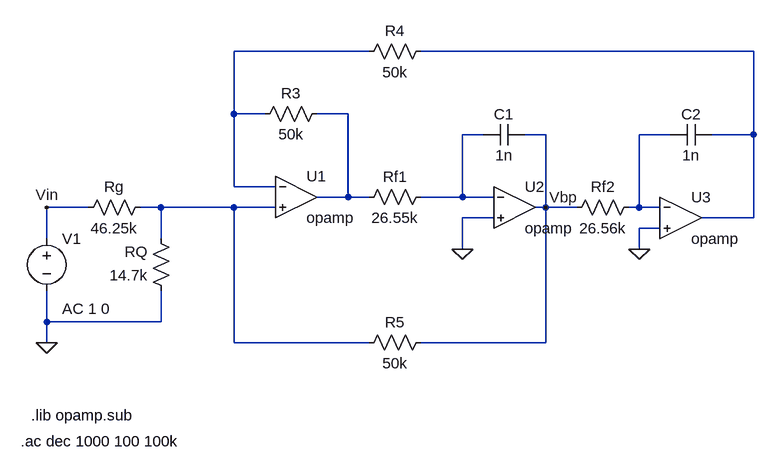
[diagram p0: schematic tplab.asc]
tplab.asc, the LTspice schematic file:
Version 4
SHEET 1 880 680
WIRE 144 -80 -64 -80
WIRE 736 -80 224 -80
WIRE -64 16 -64 -80
WIRE -16 16 -64 16
WIRE 112 16 64 16
WIRE 320 48 288 48
WIRE 416 48 384 48
WIRE 608 48 560 48
WIRE 736 48 736 -80
WIRE 736 48 672 48
WIRE -64 128 -64 16
WIRE 0 128 -64 128
WIRE 112 144 112 16
WIRE 112 144 64 144
WIRE 144 144 112 144
WIRE 288 144 288 48
WIRE 288 144 224 144
WIRE 336 144 288 144
WIRE -288 160 -352 160
WIRE -176 160 -208 160
WIRE -64 160 -176 160
WIRE 0 160 -64 160
WIRE 416 160 416 48
WIRE 416 160 400 160
WIRE 464 160 416 160
WIRE 560 160 560 48
WIRE 560 160 544 160
WIRE 592 160 560 160
WIRE 336 176 288 176
WIRE 736 176 736 48
WIRE 736 176 656 176
WIRE 592 192 560 192
WIRE -352 208 -352 160
WIRE -176 208 -176 160
WIRE 288 224 288 176
WIRE 560 224 560 192
WIRE -352 336 -352 288
WIRE -176 336 -176 288
WIRE -176 336 -352 336
WIRE -352 368 -352 336
WIRE -64 368 -64 160
WIRE 144 368 -64 368
WIRE 416 368 416 160
WIRE 416 368 224 368
FLAG -352 368 0
FLAG 288 224 0
FLAG 560 224 0
FLAG -352 160 Vin
FLAG 416 160 Vbp
SYMBOL OpAmps\\opamp 32 80 R0
SYMATTR InstName U1
SYMBOL OpAmps\\opamp 368 96 R0
SYMATTR InstName U2
SYMBOL OpAmps\\opamp 624 112 R0
SYMATTR InstName U3
SYMBOL res 240 128 R90
WINDOW 0 0 56 VBottom 2
WINDOW 3 32 56 VTop 2
SYMATTR InstName Rf1
SYMATTR Value 26.55k
SYMBOL res 560 144 R90
WINDOW 0 0 56 VBottom 2
WINDOW 3 32 56 VTop 2
SYMATTR InstName Rf2
SYMATTR Value 26.56k
SYMBOL res 80 0 R90
WINDOW 0 0 56 VBottom 2
WINDOW 3 32 56 VTop 2
SYMATTR InstName R3
SYMATTR Value 50k
SYMBOL res 240 -96 R90
WINDOW 0 0 56 VBottom 2
WINDOW 3 32 56 VTop 2
SYMATTR InstName R4
SYMATTR Value 50k
SYMBOL res 240 352 R90
WINDOW 0 0 56 VBottom 2
WINDOW 3 32 56 VTop 2
SYMATTR InstName R5
SYMATTR Value 50k
SYMBOL res -192 144 R90
WINDOW 0 0 56 VBottom 2
WINDOW 3 32 56 VTop 2
SYMATTR InstName Rg
SYMATTR Value 46.25k
SYMBOL res -160 304 R180
WINDOW 0 36 76 Left 2
WINDOW 3 36 40 Left 2
SYMATTR InstName RQ
SYMATTR Value 14.7k
SYMBOL cap 384 32 R90
WINDOW 0 0 32 VBottom 2
WINDOW 3 32 32 VTop 2
SYMATTR InstName C1
SYMATTR Value 1n
SYMBOL cap 672 32 R90
WINDOW 0 0 32 VBottom 2
WINDOW 3 32 32 VTop 2
SYMATTR InstName C2
SYMATTR Value 1n
SYMBOL voltage -352 192 R0
WINDOW 123 24 124 Left 2
WINDOW 39 0 0 Left 2
SYMATTR Value2 AC 1 0
SYMATTR InstName V1
SYMATTR Value ""
TEXT -376 480 Left 2 !.lib opamp.sub
TEXT -392 520 Left 2 !.ac dec 1000 100 100k

The netlist it stands for:
* tplab.asc
XU1 N001 N006 N003 opamp Aol=100K GBW=10Meg  ; pins invin noninvin out
XU2 N004 0 Vbp opamp Aol=100K GBW=10Meg  ; pins invin noninvin out
XU3 N005 0 N002 opamp Aol=100K GBW=10Meg  ; pins invin noninvin out
Rf1 N004 N003 26.55k
Rf2 N005 Vbp 26.56k
R3 N003 N001 50k
R4 N002 N001 50k
R5 Vbp N006 50k
Rg N006 Vin 46.25k
RQ 0 N006 14.7k
C1 Vbp N004 1n
C2 N002 N005 1n
V1 Vin 0 AC 1 0
.lib opamp.sub
.ac dec 1000 100 100k
.backanno
.end

* Results of the author's LTspice run, read from the files saved beside the schematic
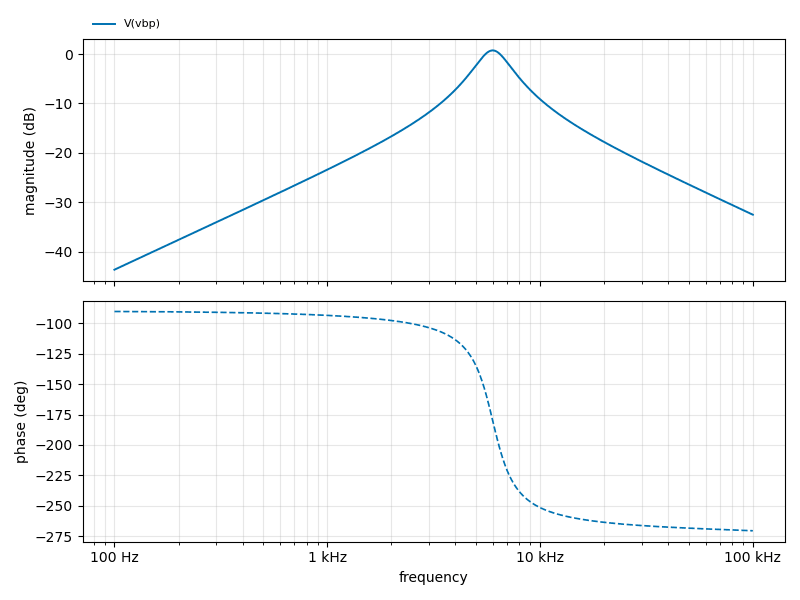
[diagram p1: AC Analysis of tplab.asc, plotted from the saved traces]
* AC Analysis, 1 run:
*   V(vbp): -43.63 dB at 100 Hz, -32.50 dB at 100 kHz, peak 0.73 dB at 5.998 kHz, 3 dB below the peak at 5.003 kHz and 7.176 kHz